# EAGLE schematic CanLogger_V21 (EAGLE 7.4.0)
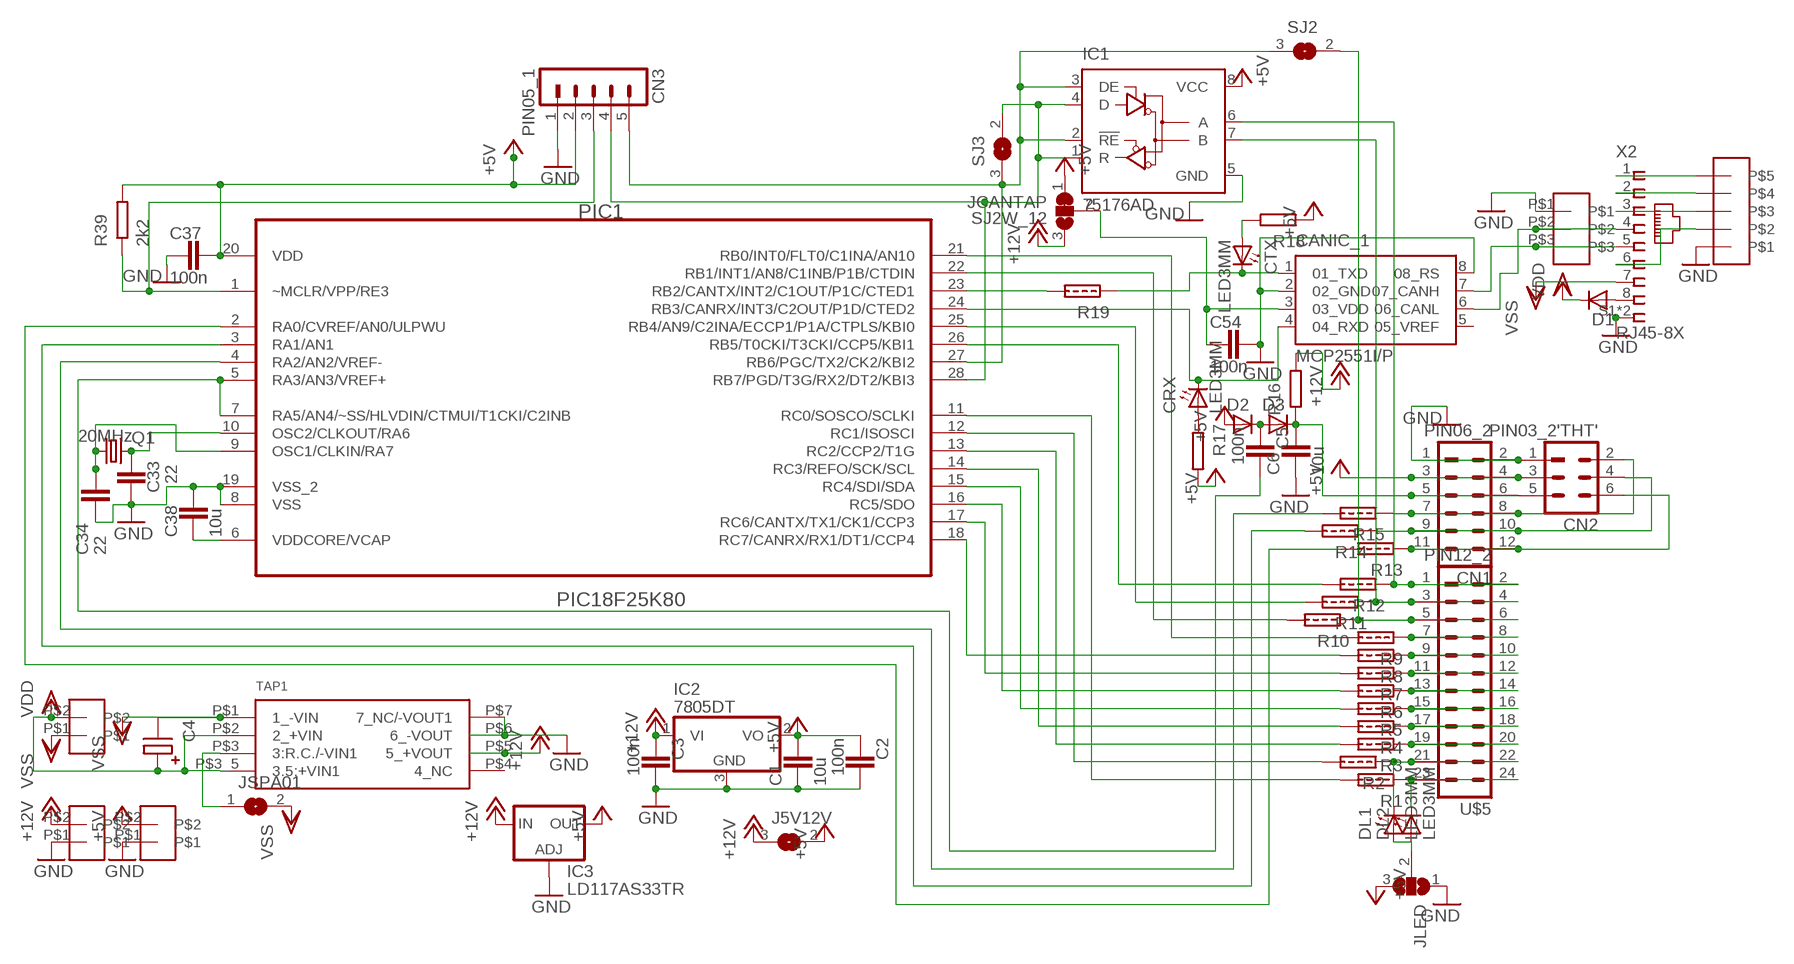
[diagram p0: schematic, sheet 1]

## Parts
C1  10u  C0805  [R0805]
C2  100n  C0805  [R0805]
C3  100n  C0805  [R0805]
C4  C_EL1R05  [C_EL1RASZT05]
C5  100n  C0805  [R0805]
C6  10u  C0805  [R0805]
C33  22  C0805  [R0805]
C34  22  C0805  [R0805]
C37  100n  C0805  [R0805]
C38  10u  C0805  [R0805]
C54  100n  C0805  [R0805]
CANIC_1  MCP2551I/P  [DIL_8]
CN1  PIN06_2  [PIN06_2]
CN2  PIN03_2'THT'  [PIN03_2]
CN3  PIN05_1  [PIN05_1]
CN_CAN  FEHER_TUS_3  [FEHER_TUS_3]
CRX  LED3MM  [LED3MM]
CTX  LED3MM  [LED3MM]
D1  D1RNAGY  [D1RASZTNAGY]
D2  D0805  [D0805]
D3  D0805  [D0805]
DL1  LED3MM  [LED3MM]
DL2  LED3MM  [LED3MM]
IC1  75176AD  [D_R-PDSO-G8]
IC2  7805DT  [TO252]
IC3  LD117AS33TR  [SOT223]
J5V12V  SJ  [SJ]
JCANTAP  SJ2W_12  [SJ2_12]
JLED  SJ2W  [SJ2]
JSPA01  SJW  [SJW]
PIC1  PIC18F25K80  [SOIC127P1030X265-28N]
Q1  20MHz  XTAL_2QS  [XTAL_QS]
R1  RNULL_EU0805  [R0805_C]
R2  RNULL_EU0805  [R0805_C]
R3  RNULL_EU0805  [R0805_C]
R4  RNULL_EU0805  [R0805_C]
R5  RNULL_EU0805  [R0805_C]
R6  RNULL_EU0805  [R0805_C]
R7  RNULL_EU0805  [R0805_C]
R8  RNULL_EU0805  [R0805_C]
R9  RNULL_EU0805  [R0805_C]
R10  RNULL_EU0805  [R0805_C]
R11  RNULL_EU0805  [R0805_C]
R12  RNULL_EU0805  [R0805_C]
R13  RNULL_EU0805  [R0805_C]
R14  RNULL_EU0805  [R0805_C]
R15  RNULL_EU0805  [R0805_C]
R16  R_EU0805  [R0805]
R17  R_EU0805  [R0805]
R18  R_EU0805  [R0805]
R19  RNULL_EU0805  [R0805_C]
R39  2k2  R_EU0805  [R0805]
SJ2  SJ  [SJ]
SJ3  SJ  [SJ]
TAP1  SPA01_02C  [SPA01_02C]
U$1  FEHER_TUS_5  [FEHER_TUS_5]
U$2  FEHER_TUS_2ALLO  [FEHER_TUS_2]
U$3  FEHER_TUS_2ALLO  [FEHER_TUS_2]
U$4  FEHER_TUS_2ALLO  [FEHER_TUS_2]
U$5  PIN12_2  [PIN12_2]
X2  RJ45-8X  [RJ45]

## Nets
+5V: C1.1 C2.2 C37.1 CN1.3 CN1.4 CN2.3 CN3.2 D2.1(A) IC1.8(VCC) IC2.2(VO) IC3.2(OUT) IC3.4(OUT) J5V12V.2 JCANTAP.1 JLED.3 PIC1.20(VDD) R17.2(E) R18.1(A) R39.2(E) U$4.P$2
+12V: C3.2 IC2.1(VI) IC3.3(IN) J5V12V.3 JCANTAP.3 R16.2(E) TAP1.P$5(5_+VOUT) U$3.P$2
GND: C1.2 C2.1 C3.1 C6.2 C33.2 C34.2 C37.2 C38.1 C54.1 CANIC_1.2(02_GND) CANIC_1.8(08_RS) CN1.1 CN1.2 CN2.1 CN3.1 CN_CAN.P$1 IC1.5(GND) IC2.3(GND) IC3.1(ADJ) JLED.1 PIC1.8(VSS) PIC1.19(VSS_2) TAP1.P$6(6_-VOUT) TAP1.P$7(7_NC/-VOUT1) U$1.P$1 U$3.P$1 U$4.P$1 X2.S1(S) X2.S2(S)
N$1: CANIC_1.7(07_CANH) CN_CAN.P$3 X2.5
N$2: IC1.7(B) R11.1(A) U$5.3 U$5.4
N$3: CANIC_1.6(06_CANL) CN_CAN.P$2 X2.4
N$4: CN3.3 PIC1.1(~MCLR/VPP/RE3) R39.1(A)
N$5: IC1.6(A) R12.1(A) U$5.1 U$5.2
N$6: R10.1(A) SJ2.2 U$5.5 U$5.6
N$7: CANIC_1.1(01_TXD) CTX.K(C) R19.1(A)
N$8: D1.P$1(A) X2.8
N$9: DL1.K(C) R2.1(A) U$5.21 U$5.22
N$10: R3.1(A) U$5.19 U$5.20
N$11: R4.1(A) U$5.17 U$5.18
N$12: R5.1(A) U$5.15 U$5.16
N$13: DL1.A DL2.A JLED.2
N$14: R6.1(A) U$5.13 U$5.14
N$15: R7.1(A) U$5.11 U$5.12
N$16: R8.1(A) U$5.9 U$5.10
N$17: R9.1(A) U$5.7 U$5.8
N$18: CRX.A R17.1(A)
N$19: CTX.A R18.2(E)
N$20: CN1.11 CN1.12 CN2.6 R13.1(A)
N$21: CN1.9 CN1.10 CN2.4 R14.1(A)
N$22: CN1.7 CN1.8 CN2.2 R15.1(A)
N$23: C5.2 D2.2(C) D3.1(A)
N$24: C6.1 CN1.5 CN1.6 CN2.5 D3.2(C) R16.1(A)
N$31: DL2.K(C) R1.1(A) U$5.23 U$5.24
N$32: PIC1.26(RB5/T0CKI/T3CKI/CCP5/KBI1) R12.2(E)
N$33: PIC1.18(RC7/CANRX/RX1/DT1/CCP4) R8.2(E)
N$34: PIC1.17(RC6/CANTX/TX1/CK1/CCP3) R7.2(E)
N$35: C33.1 PIC1.10(OSC2/CLKOUT/RA6) Q1.2
N$36: PIC1.16(RC5/SDO) R6.2(E)
N$37: PIC1.15(RC4/SDI/SDA) R5.2(E)
N$38: PIC1.14(RC3/REFO/SCK/SCL) R4.2(E)
N$39: PIC1.13(RC2/CCP2/T1G) R3.2(E)
N$40: PIC1.12(RC1/ISOSCI) R2.2(E)
N$41: PIC1.11(RC0/SOSCO/SCLKI) R1.2(E)
N$43: CANIC_1.4(04_RXD) CRX.K(C) PIC1.24(RB3/CANRX/INT3/C2OUT/P1D/CTED2)
N$44: PIC1.4(RA2/AN2/VREF-) R15.2(E)
N$45: C5.1 PIC1.5(RA3/AN3/VREF+) PIC1.7(RA5/AN4/~SS/HLVDIN/CTMUI/T1CKI/C2INB)
N$47: PIC1.21(RB0/INT0/FLT0/C1INA/AN10) R9.2(E)
N$48: PIC1.22(RB1/INT1/AN8/C1INB/P1B/CTDIN) R10.2(E)
N$49: U$1.P$5 X2.1
N$50: U$1.P$4 X2.2
N$51: U$1.P$3 X2.3
N$52: PIC1.2(RA0/CVREF/AN0/ULPWU) R13.2(E)
N$53: U$1.P$2 X2.6
N$54: PIC1.3(RA1/AN1) R14.2(E)
N$55: PIC1.25(RB4/AN9/C2INA/ECCP1/P1A/CTPLS/KBI0) R11.2(E)
N$56: JSPA01.1 TAP1.P$3(3:R.C./-VIN1)
N$62: C54.2 CANIC_1.3(03_VDD) JCANTAP.2
N$63: PIC1.23(RB2/CANTX/INT2/C1OUT/P1C/CTED1) R19.2(E)
N$81: C34.1 PIC1.9(OSC1/CLKIN/RA7) Q1.1
N$188: CN3.5 IC1.2(!RE) IC1.3(DE) PIC1.27(RB6/PGC/TX2/CK2/KBI2) SJ2.3 SJ3.3
N$223: C38.2 PIC1.6(VDDCORE/VCAP)
N$357: CN3.4 IC1.1(R) IC1.4(D) PIC1.28(RB7/PGD/T3G/RX2/DT2/KBI3) SJ3.2
VDD: C4.P+ D1.P$2(C) TAP1.P$2(2_+VIN) TAP1.P$3_5(3.5:+VIN1) U$2.P$2
VSS: C4.P- JSPA01.2 TAP1.P$1(1_-VIN) U$2.P$1 X2.7
Unconnected: CANIC_1.5(05_VREF) TAP1.P$4(4_NC)

## Library data of the parts
C1-C3 C5 C6 C33 C34 C37 C38 C54 = Cf_RLCPX:C
C4 = Cf_RLCPX:C_EL
CANIC_1 = Cf_UC:MCP2551
CN1 = Cf_Csatl:PIN06_2
CN2 = Cf_Csatl:PIN03_2
CN3 = Cf_Csatl:PIN05_1
CN_CAN = csatik:FEHER_TUS_3
CRX CTX DL1 DL2 = Cf_Felv:LED
D1-D3 = Cf_Felv:D
IC1 = narval:75176A: DIFFERENTIAL BUS TRANSCEIVER Source: http://focus.ti.com/lit/ds/symlink/sn75176a.pdf
IC2 = narval:78*: Positive VOLTAGE REGULATOR Source: http://cache.national.com/ds/LM/LM78L05.pdf http://www.fairchildsemi.com/ds/LM/LM7805.pdf
IC3 = narval:LD117A?*: Low drop fixed and adjustable positive voltage regulators 1 A Source: http://www.st.com/stonline/products/literature/ds/7194/ld1117axx.pdf
J5V12V SJ2 SJ3 = jumper2:SJ: SMD solder JUMPER
JCANTAP = jumper:SJ2W_12
JLED = jumper:SJ2W: SMD solder JUMPER
JSPA01 = jumper:SJ: SMD solder JUMPER
PIC1 = narval:PIC18F25K80
Q1 = Cf_RLCPX:XTAL_2
R1-R15 R19 = Cf_RLCPX:RNULL_EU
R16-R18 R39 = Cf_RLCPX:R_EU
TAP1 = narval:SPA01_02C
U$1 = csatik:FEHER_TUS_5
U$2-U$4 = csatik:FEHER_TUS_2
U$5 = Cf_Csatl:PIN12_2
X2 = Cf_Csatl:RJ45: CORCOM Modular RJ Jacks No Shield Source: www.tycoelectronics.com .. ENG_DS_1654001_1099_RJ_L_0507.pdf; MPN: RJ45-8X; OC_FARNELL: unknown; OC_NEWARK: 16R6101

## Net classes
0 default: width 0.305 mm, drill 0.61 mm, clearance 0.305 mm